# Altium schematic sheet base.SchDoc
size A4
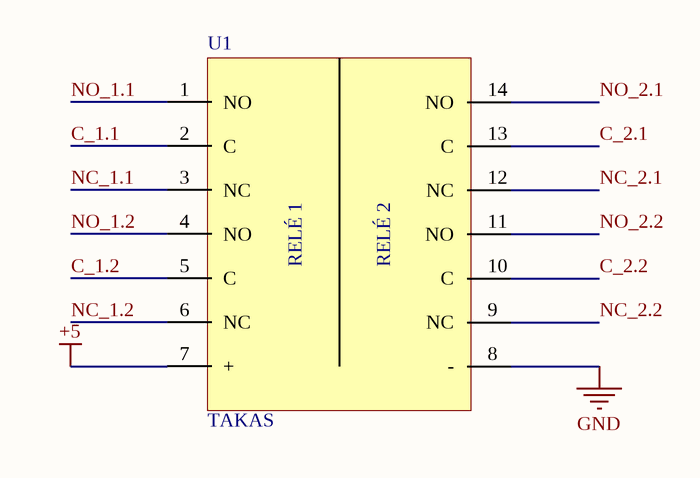
[diagram p0: base.SchDoc]

## Parts
U1  TAKAS  [base_takas]

## Nets
+5: U1.7(+)
GND: U1.8(-)
C_1.1: U1.2(C)
C_1.2: U1.5(C)
C_2.1: U1.13(C)
C_2.2: U1.10(C)
NC_1.1: U1.3(NC)
NC_1.2: U1.6(NC)
NC_2.1: U1.12(NC)
NC_2.2: U1.9(NC)
NO_1.1: U1.1(NO)
NO_1.2: U1.4(NO)
NO_2.1: U1.14(NO)
NO_2.2: U1.11(NO)

## Notes on the sheet
- (in symbol TAKAS) RELÉ 1; RELÉ 2